# Altium schematic sheet P7_DEBUG_CONN.SchDoc
size A
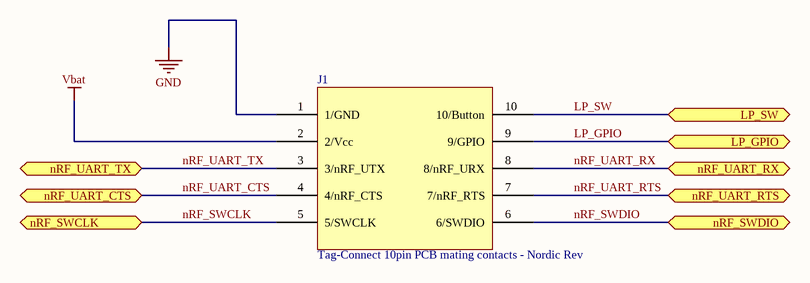
[diagram p0: P7_DEBUG_CONN.SchDoc]

## Parts
J1  Tag-Connect 10pin PCB mating contacts - Nordic Rev  [TAG_CONNECT_10P]

## Ports
LP_GPIO, LP_SW, nRF_SWCLK, nRF_SWDIO, nRF_UART_CTS, nRF_UART_RTS, nRF_UART_RX, nRF_UART_TX

## Nets
GND: J1.1(1/GND)
Vbat: J1.2(2/Vcc)
LP_GPIO: J1.9(9/GPIO) ; port LP_GPIO
LP_SW: J1.10(10/Button) ; port LP_SW
nRF_SWCLK: J1.5(5/SWCLK) ; port nRF_SWCLK
nRF_SWDIO: J1.6(6/SWDIO) ; port nRF_SWDIO
nRF_UART_CTS: J1.4(4/nRF_CTS) ; port nRF_UART_CTS
nRF_UART_RTS: J1.7(7/nRF_RTS) ; port nRF_UART_RTS
nRF_UART_RX: J1.8(8/nRF_URX) ; port nRF_UART_RX
nRF_UART_TX: J1.3(3/nRF_UTX) ; port nRF_UART_TX

## Library data of the parts
J1 = 03-07153-000: Tag-Connect plug of nails  PCB mating contacts - Nordic REV; Legacy Item Number: J01008; Item Number: 03-07153-000; RoHS: Y; Lifecycle: Preliminary; Link to Arena Files: https://app.bom.com/a/CUDMSN6N6PPCQIZT?v=files.associations